# Altium schematic sheet W5500+HR911105A.SchDoc
size A4
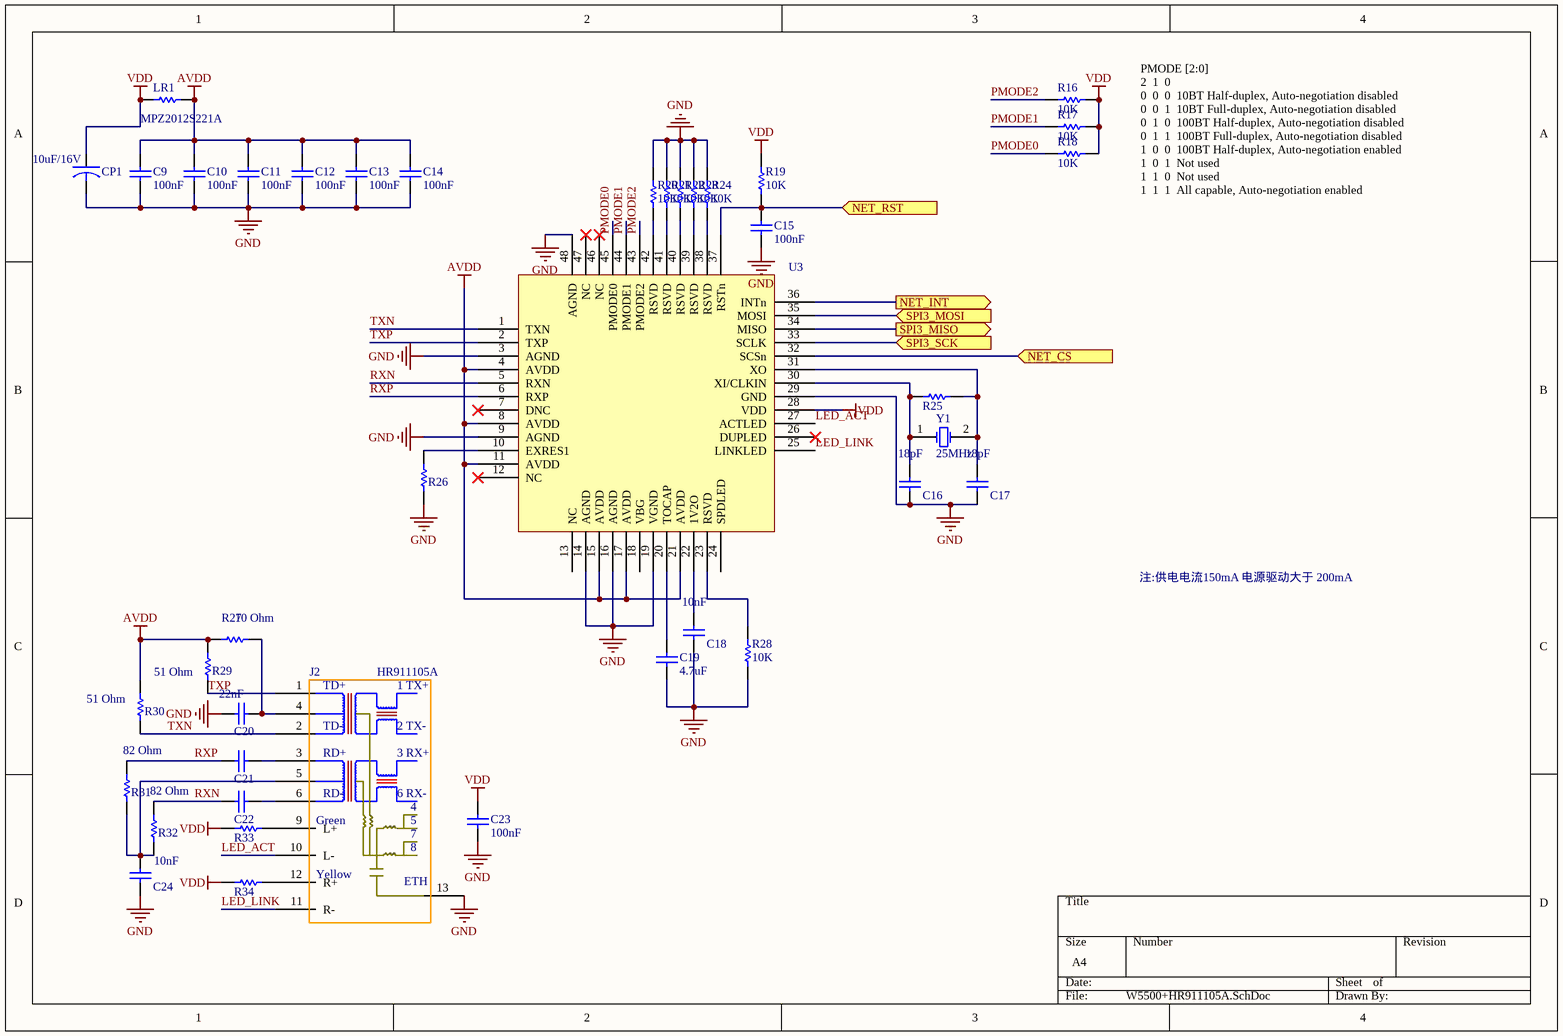
[diagram p0: W5500+HR911105A.SchDoc]

## Parts
C9  value 100nF  [2012[0805]06CD]  (hidden comment: CAP 100nF 50V 0805(2012))
C10  value 100nF  [2012[0805]06CD]  (hidden comment: CAP 100nF 50V 0805(2012))
C11  value 100nF  [2012[0805]06CD]  (hidden comment: CAP 100nF 50V 0805(2012))
C12  value 100nF  [2012[0805]06CD]  (hidden comment: CAP 100nF 50V 0805(2012))
C13  value 100nF  [2012[0805]06CD]  (hidden comment: CAP 100nF 50V 0805(2012))
C14  value 100nF  [2012[0805]06CD]  (hidden comment: CAP 100nF 50V 0805(2012))
C15  value 100nF  [2012[0805]06CD]  (hidden comment: CAP 100nF 50V 0805(2012))
C16  value 18pF  [2012[0805]100_L]  (hidden comment: CAP 18pF 50V 0805(2012))
C17  value 18pF  [2012[0805]100_L]  (hidden comment: CAP 18pF 50V 0805(2012))
C18  value 10nF  [2012[0805]100_L]  (hidden comment: CAP 10nF 50V 0805(2012))
C19  value 4.7uF  [2012[0805]13CD]  (hidden comment: CAP 4.7uF 50V 0805(2012))
C20  value 22nF  [2012[0805]100_L]  (hidden comment: CAP 22nF 50V 0805(2012))
C21  CAP 6.8nF 50V 0805(2012)  [2012[0805]100_L]  (value not drawn)
C22  CAP 6.8nF 50V 0805(2012)  [2012[0805]100_L]  (value not drawn)
C23  value 100nF  [2012[0805]06CD]  (hidden comment: CAP 100nF 50V 0805(2012))
C24  value 10nF  [2012[0805]100_L]  (hidden comment: CAP 10nF 50V 0805(2012))
CP1  value 10uF/16V  [3216[1206]CB]  (hidden comment: TAJA106K016RNJ)
J2  HR911105A  [HR911105A]
LR1  MPZ2012S221A  [2012[0805]RL]
R16  value 10K  [2012[0805]R]  (hidden comment: 10K 1% 0805(2012))
R17  value 10K  [2012[0805]R]  (hidden comment: 10K 1% 0805(2012))
R18  value 10K  [2012[0805]R]  (hidden comment: 10K 1% 0805(2012))
R19  value 10K  [2012[0805]R]  (hidden comment: 10K 1% 0805(2012))
R20  value 10K  [2012[0805]R]  (hidden comment: 10K 1% 0805(2012))
R21  value 10K  [2012[0805]R]  (hidden comment: 10K 1% 0805(2012))
R22  value 10K  [2012[0805]R]  (hidden comment: 10K 1% 0805(2012))
R23  value 10K  [2012[0805]R]  (hidden comment: 10K 1% 0805(2012))
R24  value 10K  [2012[0805]R]  (hidden comment: 10K 1% 0805(2012))
R25  1M 1% 0805(2012)  [2012[0805]R]  (value not drawn)
R26  12K4 1% 0805(2012)  [2012[0805]R]  (value not drawn)
R27  value 10 Ohm  [2012[0805]R]  (hidden comment: 10R 5% 0805(2012))
R28  value 10K  [2012[0805]R]  (hidden comment: 10K 1% 0805(2012))
R29  value 51 Ohm  [2012[0805]R]  (hidden comment: 51R 5% 0805(2012))
R30  value 51 Ohm  [2012[0805]R]  (hidden comment: 51R 5% 0805(2012))
R31  value 82 Ohm  [2012[0805]R]  (hidden comment: 82R 5% 0805(2012))
R32  value 82 Ohm  [2012[0805]R]  (hidden comment: 82R 5% 0805(2012))
R33  270R 5% 0805(2012)  [2012[0805]R]  (value not drawn)
R34  270R 5% 0805(2012)  [2012[0805]R]  (value not drawn)
U3  W5500  [LQFP48_N]  (value not drawn)
Y1  25MHz  [XTAL_HC-49]

## Ports
NET_CS (in), NET_INT (out), NET_RST (in), SPI3_MISO (out), SPI3_MOSI (in), SPI3_SCK (in)

## Nets
AVDD: C9.1 C10.1 C11.1 C12.1 C13.1 C14.1 LR1.1 R27.2 R29.2 R30.2 U3.4(AVDD) U3.8(AVDD) U3.11(AVDD) U3.15(AVDD) U3.17(AVDD) U3.21(AVDD)
GND: C9.2 C10.2 C11.2 C12.2 C13.2 C14.2 C15.2 C16.1 C17.1 C18.1 C19.2 C20.1 C23.2 C24.1 CP1.2 J2.13 R20.1 R21.1 R22.1 R23.1 R24.1 R26.1 R28.2 U3.3(AGND) U3.9(AGND) U3.14(AGND) U3.16(AGND) U3.19(VGND) U3.29(GND) U3.48(AGND)
VDD: C23.1 CP1.1 LR1.2 R16.1 R17.1 R18.1 R19.1 R33.1 R34.1 U3.28(VDD)
LED_ACT: J2.10(L-) U3.27(ACTLED)
LED_LINK: J2.11(R-) U3.25(LINKLED)
NET_CS: U3.32(SCSn) ; port NET_CS
NET_INT: U3.36(INTn) ; port NET_INT
NET_RST: C15.1 R19.2 U3.37(RSTn) ; port NET_RST
PMODE0: R18.2 U3.45(PMODE0)
PMODE1: R17.2 U3.44(PMODE1)
PMODE2: R16.2 U3.43(PMODE2)
RXN: C22.1 R32.2 U3.5(RXN)
RXP: C21.1 R31.2 U3.6(RXP)
SPI3_MISO: U3.34(MISO) ; port SPI3_MISO
SPI3_MOSI: U3.35(MOSI) ; port SPI3_MOSI
SPI3_SCK: U3.33(SCLK) ; port SPI3_SCK
TXN: J2.2 R30.1 U3.1(TXN)
TXP: J2.1 R29.1 U3.2(TXP)
NetC16_2: C16.2 R25.1 U3.30(XI/CLKIN) Y1.1(OSC1)
NetC17_2: C17.2 R25.2 U3.31(XO) Y1.2(OSC2)
NetC18_2: C18.2 U3.22(1V2O)
NetC19_1: C19.1 U3.20(TOCAP)
NetC20_2: C20.2 J2.4 R27.1
NetC21_2: C21.2 J2.3
NetC22_2: C22.2 J2.6
NetC24_2: C24.2 J2.5 R31.1 R32.1
NetJ2_9: J2.9(L+) R33.2
NetJ2_12: J2.12(R+) R34.2
NetR20_2: R20.2 U3.42(RSVD)
NetR21_2: R21.2 U3.41(RSVD)
NetR22_2: R22.2 U3.40(RSVD)
NetR23_2: R23.2 U3.39(RSVD)
NetR24_2: R24.2 U3.38(RSVD)
NetR26_2: R26.2 U3.10(EXRES1)
NetR28_1: R28.1 U3.23(RSVD)

Not connected (* = marked no-connect by the designer): U3 7(DNC)* 12(NC)* 13(NC) 18(VBG) 24(SPDLED) 26(DUPLED)* 46(NC)* 47(NC)*

## Notes on the sheet
- PMODE [2:0]
  2  1  0
  0  0  0  10BT Half-duplex, Auto-negotiation disabled
  0  0  1  10BT Full-duplex, Auto-negotiation disabled
  0  1  0  100BT Half-duplex, Auto-negotiation disabled
  0  1  1  100BT Full-duplex, Auto-negotiation disabled
  1  0  0  100BT Half-duplex, Auto-negotiation enabled
  1  0  1  Not used
  1  1  0  Not used
  1  1  1  All capable, Auto-negotiation enabled
- 注:供电电流150mA 电源驱动大于 200mA
- (in symbol HR911102) TD+; 1 TX+; TD-; 2 TX-; RD+; 3 RX+; RD-; 6 RX-; Green; 7; 8; Yellow; ETH

## Library data of the parts
C9-C14 C23 = CMP-1036-04418-1: CAP 100nF 50V ±5% 0805 (2012 Metric) Thickness 1mm SMD; Case-EIA: 0805; Case-Metric: 2012; Tolerance: ±5%; Max Thickness: 1 mm; Technology: SMT; Rated Voltage: 50 V
C15 = CMP-1036-04417-1: CAP 100nF 50V ±5% 0805 (2012 Metric) Thickness 1.45mm SMD; Case-Metric: 2012; Case-EIA: 0805; Max Thickness: 1.45 mm; Tolerance: ±5%; Rated Voltage: 50 V; Technology: SMT
C16 C17 = CMP-1036-01136-1: CAP 18pF 50V ±1% 0805 (2012 Metric) Thickness 0.75mm SMD; Case-EIA: 0805; Case-Metric: 2012; Technology: SMT; Tolerance: ±1%; Max Thickness: 0.75 mm; Rated Voltage: 50 V
C18 C24 = CMP-1036-03837-1: CAP 10nF 50V ±1% 0805 (2012 Metric) Thickness 1mm SMD; Case-Metric: 2012; Case-EIA: 0805; Tolerance: ±1%; Rated Voltage: 50 V; Max Thickness: 1 mm; Technology: SMT
C19 = CMP-1036-04900-1: CAP 4.7uF 50V ±10% 0805 (2012 Metric) Thickness 1.45mm SMD; Case-Metric: 2012; Case-EIA: 0805; Tolerance: ±10%; Technology: SMT; Max Thickness: 1.45 mm; Rated Voltage: 50 V
C20 = CMP-1036-04061-1: CAP 22nF 50V ±5% 0805 (2012 Metric) Thickness 1.2mm SMD; Case-Metric: 2012; Case-EIA: 0805; Max Thickness: 1.2 mm; Rated Voltage: 50 V; Technology: SMT; Tolerance: ±5%
C21 C22 = CMP-1036-03703-1: CAP 6.8nF 50V ±1% 0805 (2012 Metric) Thickness 1mm SMD; Case-Metric: 2012; Case-EIA: 0805; Value: 6.8nF; Tolerance: ±1%; Max Thickness: 1 mm; Technology: SMT; Rated Voltage: 50 V
CP1 = CAPACITOR: 钽质电容器-固体SMD 16volts 10uF 10%; Manufacturer: AVX; ESR: 3 Ohms; 产品: Tantalum Solid Standard Grade - Other Various; 产品种类: SMD Tantalum Capacitors; 制造商库存号: A Case; 外壳代码 - in: 1206; 外壳代码 - mm: 3216; 封装 / 箱体: 1206 (3216 metric); 封装: Reel; 尺寸: 1.6 mm W x 3.2 mm L; 工作温度范围: - 55 C to + 125 C; 损耗因数 DF: 8; 标准包装数量: 2000; 漏泄电流: 1.6 uA; 电压额定值: 16 V; 端接类型: SMD/SMT; 系列: TAJ; 高度: 1.8 mm; Category: 钽质电容器-固体SMD; ComponentLink1Description: http://www.avx.com/docs/Catalogs/taj.pdf; ComponentLink1URL: http://www.avx.com/docs/Catalogs/taj.pdf; Description 1: 钽质电容器-固体SMD 16volts 10uF 10%; Manufacturer Part Number: TAJA106K016RNJ; Minimum Order Quantity: 1; Pricing 1: 1=0.600, 100=0.280, 200=0.250, 500=0.221, 1000=0.200, 2000=0.140, 5000=0.131, 10000=0.124, 25000=0.103 (USD); Reeling: True; RoHS - 贸泽: Y; RoHS: RoHS Compliant; Stock 1: 20335; Supplier 1: Mouser; Supplier Part Number 1: 581-TAJA106K016R; 制造商: AVX; 容差: 10 %; 电容: 10 uF
J2 = HR911102
LR1 = Res Semi: 电磁干扰滤波珠子、扼流圈和阵列 Ferrite Chip Beads; Manufacturer: TDK; 阻抗: 220 Ohms; 最大直流电流: 3 A; 最大直流电阻: 0.04 Ohms; 工作温度范围: - 55 C to + 125 C; 封装 / 箱体: 2012; 封装: Reel; 端接类型: SMD/SMT; 容差: 25 %; 产品种类: Ferrite Beads; 标准包装数量: 4000; Supplier 1: Mouser; Supplier Part Number 1: 810-MPZ2012S221A; Manufacturer Part Number: MPZ2012S221A; RoHS: RoHS Compliant; Description 1: 电磁干扰滤波珠子、扼流圈和阵列 Ferrite Chip Beads; Category: 电磁干扰滤波珠子、扼流圈和阵列; Stock 1: 26540; Pricing 1: 1=0.070, 50=0.060, 100=0.053, 500=0.040, 1000=0.035, 4000=0.031, 8000=0.029, 12000=0.025 (USD); 制造商: TDK; RoHS - 贸泽: Y; Minimum Order Quantity: 1; Reeling: True; ComponentLink1URL: http://www.mouser.com/ds/2/400/e9413_mpz-24582.pdf; ComponentLink1Description: http://www.mouser.com/ds/2/400/e9413_mpz-24582.pdf
R16-R24 R28 = CMP-1013-00623-1: 10K 0.125W 1% 0805 (2012 Metric)  SMD; Case-Metric: 2012; Case-EIA: 0805; Tolerance: 1 %; Power: 0.125 W; Technology: SMT
R25 = CMP-1013-00849-1: 1M 0.125W 1% 0805 (2012 Metric)  SMD; Value: 1000000.00 Ohm; Case-Metric: 2012; Case-EIA: 0805; Technology: SMT; Power: 0.125 W; Tolerance: 1 %
R26 = CMP-1013-00633-1: 12K4 0.125W 1% 0805 (2012 Metric)  SMD; Case-EIA: 0805; Case-Metric: 2012; Power: 0.125 W; Tolerance: 1 %; Technology: SMT; Value: 12K4
R27 = CMP-1013-00026-1: 10R 0.125W 5% 0805 (2012 Metric)  SMD; Case-EIA: 0805; Case-Metric: 2012; Technology: SMT; Power: 0.125 W; Tolerance: 5 %
R29 R30 = CMP-1013-00043-1: 51R 0.125W 5% 0805 (2012 Metric)  SMD; Case-Metric: 2012; Case-EIA: 0805; Technology: SMT; Tolerance: 5 %; Power: 0.125 W
R31 R32 = CMP-1013-00048-1: 82R 0.125W 5% 0805 (2012 Metric)  SMD; Case-EIA: 0805; Case-Metric: 2012; Power: 0.125 W; Tolerance: 5 %; Technology: SMT
R33 R34 = CMP-1013-00060-1: 270R 0.125W 5% 0805 (2012 Metric)  SMD; Value: 270.00 Ohm; Case-Metric: 2012; Case-EIA: 0805; Power: 0.125 W; Technology: SMT; Tolerance: 5 %
U3 = W5500: 以太网
Y1 = XTAL: Crystal Oscillator; Published: 8-Jun-2000; LatestRevisionDate: 17-Jul-2002; LatestRevisionNote: Re-released for DXP Platform.; Publisher: Altium Limited